# EAGLE design SmartMDCPrint (EAGLE 7.4.0)
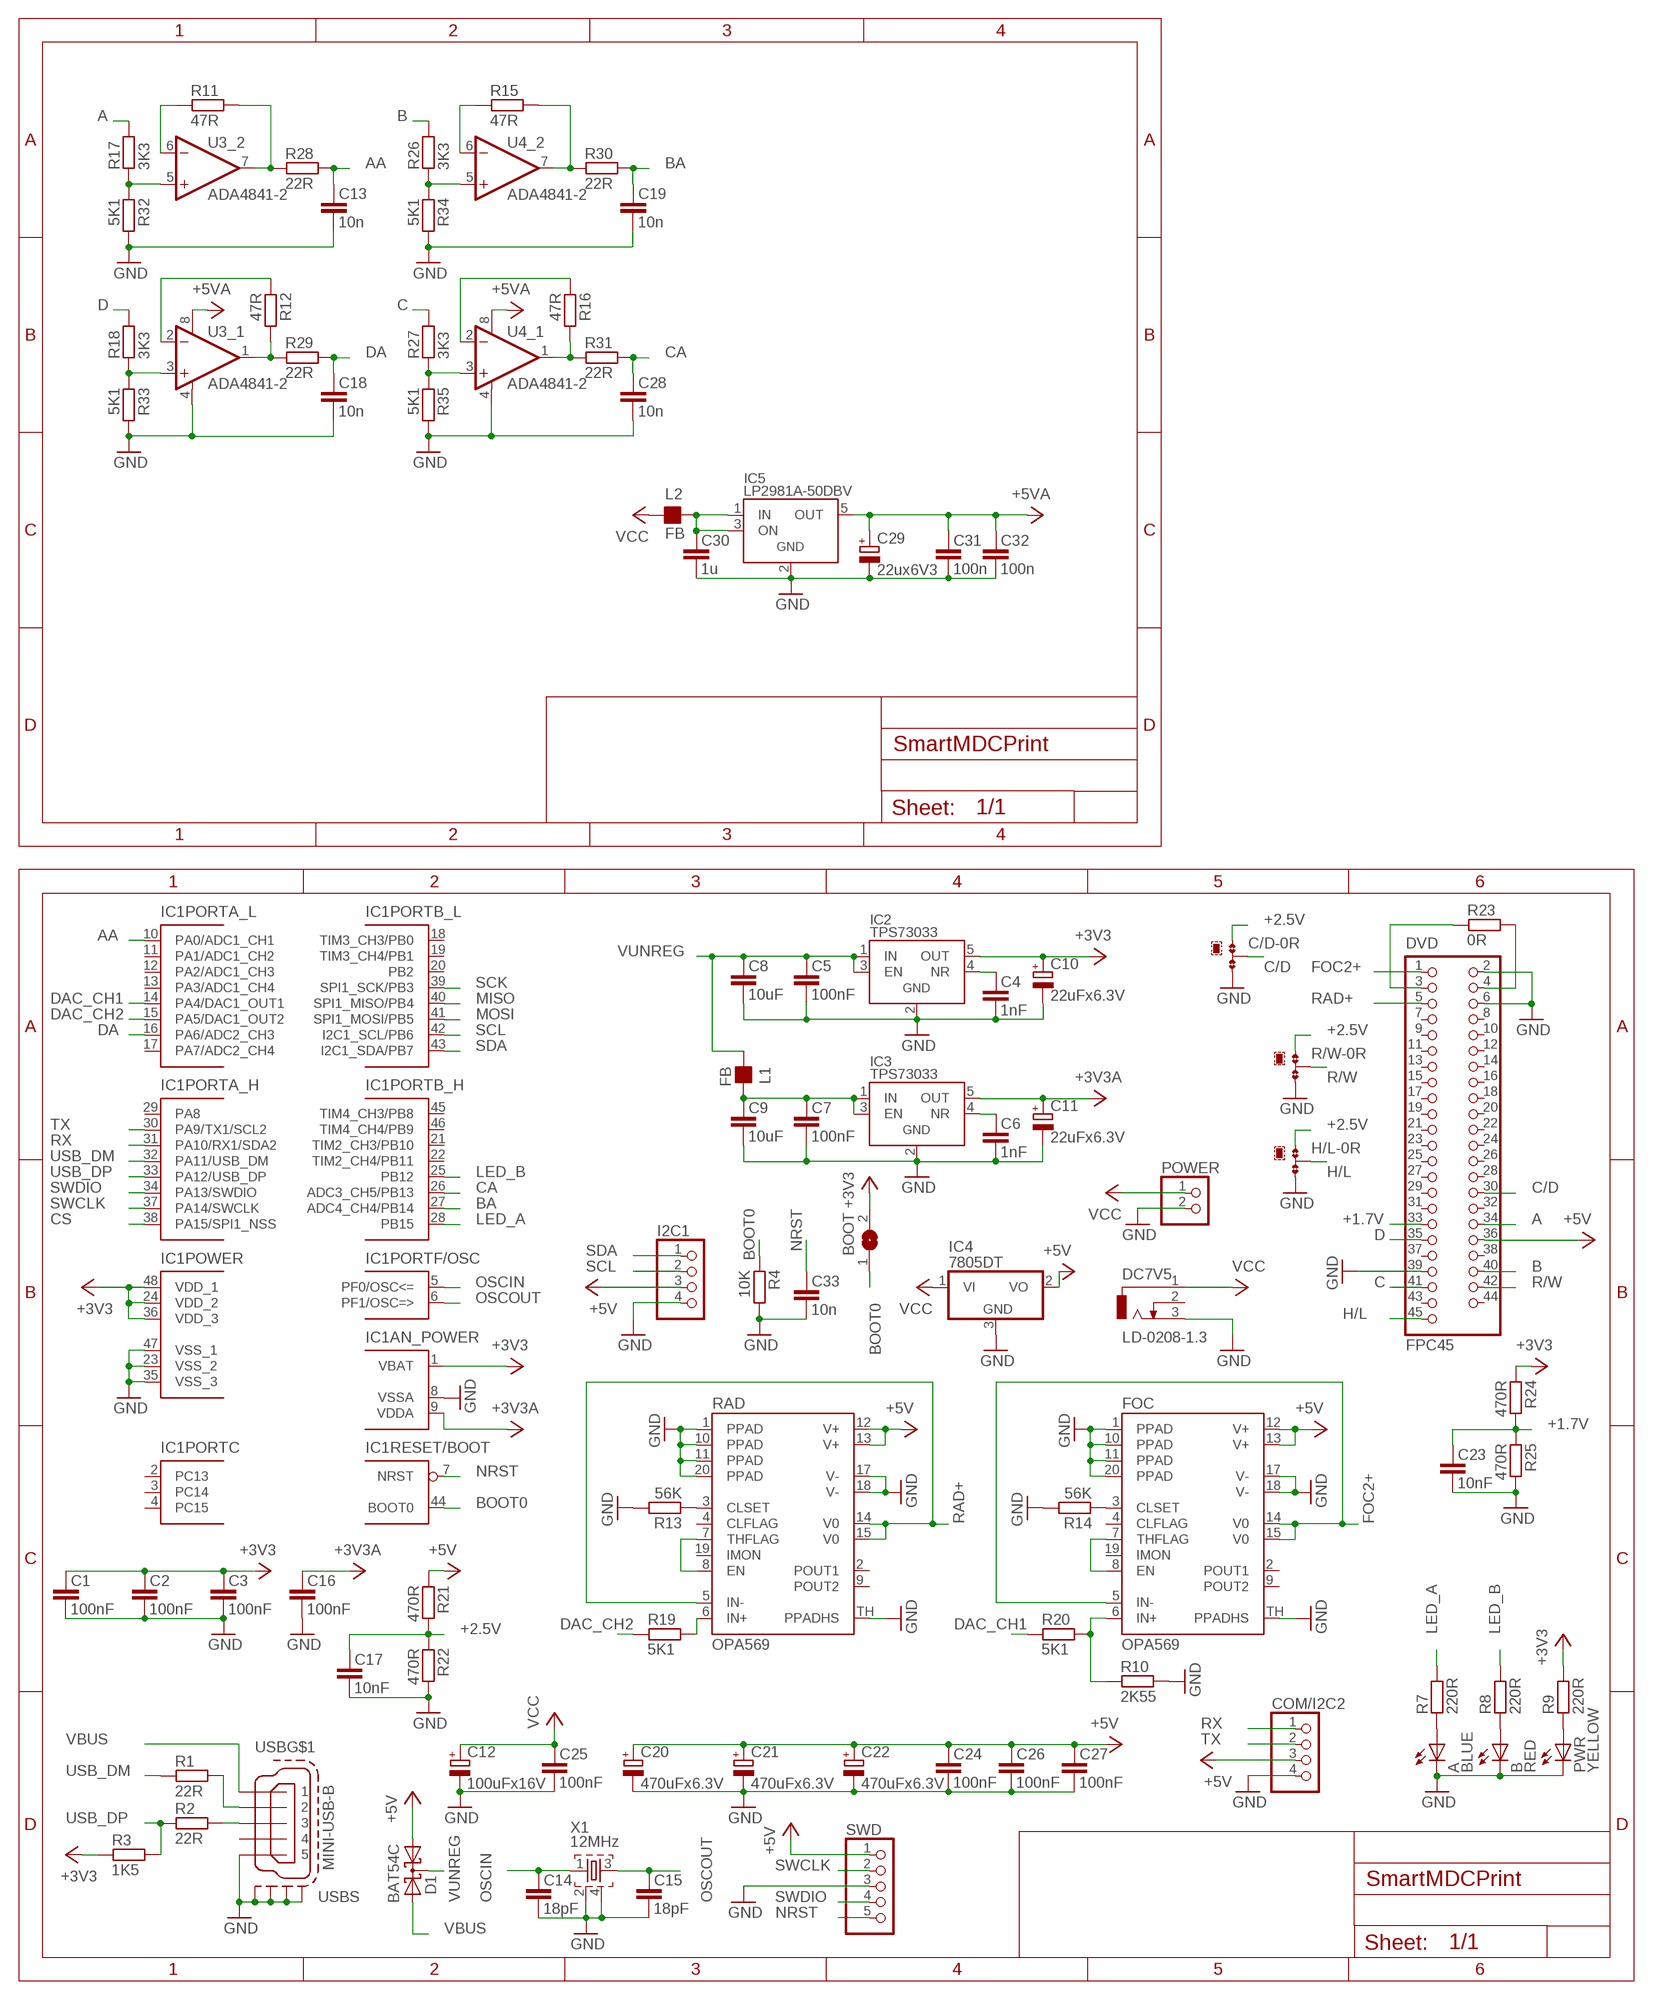
[diagram p0: schematic, sheet 1]

## Parts
A  BLUE  LEDCHIPLED_0805  [CHIPLED_0805]
B  RED  LEDCHIPLED_0805  [CHIPLED_0805]
BOOT  SJ  [SJ]
C1  100nF  C_EU_C0603G  [C0603G]
C2  100nF  C_EU_C0603G  [C0603G]
C3  100nF  C_EU_C0603G  [C0603G]
C4  1nF  C_EU_C0603G  [C0603G]
C5  100nF  C_EU_C0603G  [C0603G]
C6  1nF  C_EU_C0603G  [C0603G]
C7  100nF  C_EU_C0603G  [C0603G]
C8  10uF  C_EU_C0805  [C0805]
C9  10uF  C_EU_C0805  [C0805]
C10  22uFx6.3V  CPOL-EUSMCA  [SMC_A]
C11  22uFx6.3V  CPOL-EUSMCA  [SMC_A]
C12  100uFx16V  CPOL-EUE2.5-7  [E2,5-7]
C13  10n  C_EU_C0603G  [C0603G]
C14  18pF  C_EU_C0603G  [C0603G]
C15  18pF  C_EU_C0603G  [C0603G]
C16  100nF  C_EU_C0603G  [C0603G]
C17  10nF  C_EU_C0603G  [C0603G]
C18  10n  C_EU_C0603G  [C0603G]
C19  10n  C_EU_C0603G  [C0603G]
C20  470uFx6.3V  CPOL-EUSMCD  [SMC_D]
C21  470uFx6.3V  CPOL-EUSMCD  [SMC_D]
C22  470uFx6.3V  CPOL-EUSMCD  [SMC_D]
C23  10nF  C_EU_C0603G  [C0603G]
C24  100nF  C_EU_C0603G  [C0603G]
C25  100nF  C_EU_C0603G  [C0603G]
C26  100nF  C_EU_C0603G  [C0603G]
C27  100nF  C_EU_C0603G  [C0603G]
C28  10n  C_EU_C0603G  [C0603G]
C29  22ux6V3  CPOL-EUSMCA  [SMC_A]
C30  1u  C_EU_C0603G  [C0603G]
C31  100n  C_EU_C0603G  [C0603G]
C32  100n  C_EU_C0603G  [C0603G]
C33  10n  C_EU_C0603G  [C0603G]
C/D  0R-JUMPA  [A0R-JMP]
COM/I2C2  PINHD-1X4  [1X04]
D1  BAT54C  [SOT23]
DC7V5  LD-0208-1.3  [LD-0208]
DVD  FPC45  CON-FPC45  [FPC45]
FOC  OPA569  [SO-20]
H/L  0R-JUMPA  [A0R-JMP]
I2C1  PINHD-1X4  [1X04]
IC1  STM32F303CCT6  STM32F303CXT6  [LQFP48]
IC2  TPS73033  TPS769XX  [SOT23-5]
IC3  TPS73033  TPS769XX  [SOT23-5]
IC4  7805DT  [TO252]
IC5  LP2981A-50DBV  [SOT23-5]
L1  FB  FB_0603  [L0603]
L2  FB  FB_0603  [L0603]
POWER  PINHD-1X2  [1X02]
PWR  YELLOW  LEDCHIPLED_0805  [CHIPLED_0805]
R1  22R  R_EU_R0603  [R0603]
R2  22R  R_EU_R0603  [R0603]
R3  1K5  R_EU_R0603  [R0603]
R4  10K  R_EU_R0603G  [R0603G]
R7  220R  R_EU_R0603  [R0603]
R8  220R  R_EU_R0603  [R0603]
R9  220R  R_EU_R0603  [R0603]
R10  2K55  R_EU_R0603G  [R0603G]
R11  47R  R_EU_R0603  [R0603]
R12  47R  R_EU_R0603  [R0603]
R13  56K  R_EU_R0603G  [R0603G]
R14  56K  R_EU_R0603G  [R0603G]
R15  47R  R_EU_R0603  [R0603]
R16  47R  R_EU_R0603  [R0603]
R17  3K3  R_EU_R0603  [R0603]
R18  3K3  R_EU_R0603  [R0603]
R19  5K1  R_EU_R0603  [R0603]
R20  5K1  R_EU_R0603  [R0603]
R21  470R  R_EU_R0603  [R0603]
R22  470R  R_EU_R0603G  [R0603G]
R23  0R  R_EU_R0603  [R0603]
R24  470R  R_EU_R0603  [R0603]
R25  470R  R_EU_R0603G  [R0603G]
R26  3K3  R_EU_R0603  [R0603]
R27  3K3  R_EU_R0603  [R0603]
R28  22R  R_EU_R0603  [R0603]
R29  22R  R_EU_R0603  [R0603]
R30  22R  R_EU_R0603  [R0603]
R31  22R  R_EU_R0603  [R0603]
R32  5K1  R_EU_R0603G  [R0603G]
R33  5K1  R_EU_R0603G  [R0603G]
R34  5K1  R_EU_R0603G  [R0603G]
R35  5K1  R_EU_R0603G  [R0603G]
R/W  0R-JUMPA  [A0R-JMP]
RAD  OPA569  [SO-20]
SWD  PINHD-1X5  [1X05]
U3  ADA4841-2  [SOIC-8]
U4  ADA4841-2  [SOIC-8]
USB  MINI-USB-B  MINI-USB-SCHIELD-32005-201  [32005-201]
X1  12MHz  ABMM2  [ABMM2]

## Nets
+1.7V: C23.1 DVD.33 R24.2 R25.1
+2.5V: C17.1 C/D.1 H/L.1 R21.2 R22.1 R/W.1
+3V3: BOOT.2 C1.1 C2.1 C3.1 C10.+ IC1.1(AN_POWER:VBAT) IC1.24(POWER:VDD_2) IC1.36(POWER:VDD_3) IC1.48(POWER:VDD_1) IC2.5(OUT) R3.1 R9.2 R24.1
+3V3A: C11.+ C16.1 IC1.9(AN_POWER:VDDA) IC3.5(OUT)
+5V: C20.+ C21.+ C22.+ C24.1 C26.1 C27.1 COM/I2C2.3 D1.1(A1) DVD.36 FOC.12(V+) FOC.13(V+) I2C1.3 IC4.2(VO) R21.1 RAD.12(V+) RAD.13(V+) SWD.1
+5VA: C29.+ C31.1 C32.1 IC5.5(OUT) U3.8(_1:V+) U4.8(_1:V+)
A: DVD.34 R17.2
AA: C13.1 IC1.10(PORTA_L:PA0/ADC1_CH1) R28.2
B: DVD.40 R26.2
BA: C19.1 IC1.27(PORTB_H:ADC4_CH4/PB14) R30.2
BOOT0: BOOT.1 IC1.44(RESET/BOOT:BOOT0) R4.1
C: DVD.41 R27.2
C/D: C/D.2 DVD.30
CA: C28.1 IC1.26(PORTB_H:ADC3_CH5/PB13) R31.2
CS: IC1.38(PORTA_H:PA15/SPI1_NSS)
D: DVD.35 R18.2
DA: C18.1 IC1.16(PORTA_L:PA6/ADC2_CH3) R29.2
DAC_CH1: IC1.14(PORTA_L:PA4/DAC1_OUT1) R20.1
DAC_CH2: IC1.15(PORTA_L:PA5/DAC1_OUT2) R19.1
FOC2+: DVD.1 FOC.5(IN-) FOC.14(V0) FOC.15(V0)
GND: A.C B.C C1.2 C2.2 C3.2 C4.2 C5.2 C6.2 C7.2 C8.2 C9.2 C10.- C11.- C12.- C13.2 C14.2 C15.2 C16.2 C17.2 C18.2 C19.2 C20.- C21.- C22.- C23.2 C24.2 C25.2 C26.2 C27.2 C28.2 C29.- C30.2 C31.2 C32.2 C33.2 C/D.3 COM/I2C2.4 DC7V5.3 DVD.2 DVD.6 DVD.39 FOC.1(PPAD) FOC.10(PPAD) FOC.11(PPAD) FOC.17(V-) FOC.18(V-) FOC.20(PPAD) FOC.TH(PPADHS) H/L.3 I2C1.4 IC1.8(AN_POWER:VSSA) IC1.23(POWER:VSS_2) IC1.35(POWER:VSS_3) IC1.47(POWER:VSS_1) IC2.2(GND) IC3.2(GND) IC4.3(GND) IC5.2(GND) POWER.2 PWR.C R4.2 R10.2 R13.2 R14.2 R22.2 R25.2 R32.2 R33.2 R34.2 R35.2 R/W.3 RAD.1(PPAD) RAD.10(PPAD) RAD.11(PPAD) RAD.17(V-) RAD.18(V-) RAD.20(PPAD) RAD.TH(PPADHS) SWD.3 U3.4(_1:V-) U4.4(_1:V-) USB.5 USB.M1(S:S1) USB.M2(S:S2) USB.M3(S:S3) USB.M4(S:S4) X1.2 X1.4
H/L: DVD.45 H/L.2
LED_A: IC1.28(PORTB_H:PB15) R7.2
LED_B: IC1.25(PORTB_H:PB12) R8.2
MISO: IC1.40(PORTB_L:SPI1_MISO/PB4)
MOSI: IC1.41(PORTB_L:SPI1_MOSI/PB5)
N$1: C7.1 C9.1 IC3.1(IN) IC3.3(EN) L1.2
N$2: R1.2 USB.2
N$3: R2.2 USB.3
N$4: R11.2 R28.1 U3.7(_2:OUT)
N$5: A.A R7.1
N$6: B.A R8.1
N$7: C4.1 IC2.4(NR)
N$8: C6.1 IC3.4(NR)
N$9: PWR.A R9.1
N$10: R12.2 R29.1 U3.1(_1:OUT)
N$11: R13.1 RAD.3(CLSET)
N$12: R19.2 RAD.6(IN+)
N$13: FOC.6(IN+) R10.1 R20.2
N$14: R15.2 R30.1 U4.7(_2:OUT)
N$15: DVD.3 R23.1
N$16: R16.2 R31.1 U4.1(_1:OUT)
N$17: FOC.7(THFLAG) FOC.8(EN)
N$18: FOC.3(CLSET) R14.1
N$19: R11.1 U3.6(_2:-IN)
N$20: R15.1 U4.6(_2:-IN)
N$21: R16.1 U4.2(_1:-IN)
N$22: R12.1 U3.2(_1:-IN)
N$23: R17.1 R32.1 U3.5(_2:+IN)
N$24: DVD.4 R23.2
N$25: R18.1 R33.1 U3.3(_1:+IN)
N$26: R26.1 R34.1 U4.5(_2:+IN)
N$27: R27.1 R35.1 U4.3(_1:+IN)
N$28: C30.1 IC5.1(IN) IC5.3(ON) L2.2
N$29: RAD.7(THFLAG) RAD.8(EN)
NRST: C33.1 IC1.7(RESET/BOOT:NRST) SWD.5
OSCIN: C14.1 IC1.5(PORTF/OSC:PF0/OSC<=) X1.1
OSCOUT: C15.1 IC1.6(PORTF/OSC:PF1/OSC=>) X1.3
R/W: DVD.42 R/W.2
RAD+: DVD.5 RAD.5(IN-) RAD.14(V0) RAD.15(V0)
RX: COM/I2C2.1 IC1.31(PORTA_H:PA10/RX1/SDA2)
SCK: IC1.39(PORTB_L:SPI1_SCK/PB3)
SCL: I2C1.2 IC1.42(PORTB_L:I2C1_SCL/PB6)
SDA: I2C1.1 IC1.43(PORTB_L:I2C1_SDA/PB7)
SWCLK: IC1.37(PORTA_H:PA14/SWCLK) SWD.2
SWDIO: IC1.34(PORTA_H:PA13/SWDIO) SWD.4
TX: COM/I2C2.2 IC1.30(PORTA_H:PA9/TX1/SCL2)
USB_DM: IC1.32(PORTA_H:PA11/USB_DM) R1.1
USB_DP: IC1.33(PORTA_H:PA12/USB_DP) R2.1 R3.2
VBUS: D1.2(A2) USB.1
VCC: C12.+ C25.1 DC7V5.1 IC4.1(VI) L2.1 POWER.1
VUNREG: C5.1 C8.1 D1.3(CC) IC2.1(IN) IC2.3(EN) L1.1
Unconnected: DC7V5.2 DVD.7 DVD.8 DVD.9 DVD.10 DVD.11 DVD.12 DVD.13 DVD.14 DVD.15 DVD.16 DVD.17 DVD.18 DVD.19 DVD.20 DVD.21 DVD.22 DVD.23 DVD.24 DVD.25 DVD.26 DVD.27 DVD.28 DVD.29 DVD.31 DVD.32 DVD.37 DVD.38 DVD.43 DVD.44 FOC.2(POUT1) FOC.4(CLFLAG) FOC.9(POUT2) FOC.19(IMON) IC1.2(PORTC:PC13) IC1.3(PORTC:PC14) IC1.4(PORTC:PC15) IC1.11(PORTA_L:PA1/ADC1_CH2) IC1.12(PORTA_L:PA2/ADC1_CH3) IC1.13(PORTA_L:PA3/ADC1_CH4) IC1.17(PORTA_L:PA7/ADC2_CH4) IC1.18(PORTB_L:TIM3_CH3/PB0) IC1.19(PORTB_L:TIM3_CH4/PB1) IC1.20(PORTB_L:PB2) IC1.21(PORTB_H:TIM2_CH3/PB10) IC1.22(PORTB_H:TIM2_CH4/PB11) IC1.29(PORTA_H:PA8) IC1.45(PORTB_H:TIM4_CH3/PB8) IC1.46(PORTB_H:TIM4_CH4/PB9) RAD.2(POUT1) RAD.4(CLFLAG) RAD.9(POUT2) RAD.19(IMON) USB.4

## Library data of the parts
A B PWR = SmartMDCPrint:LED
BOOT = SmartMDCPrint:SJ: SMD solder JUMPER
C1-C9 C13-C19 C23-C28 C30-C33 = SmartMDCPrint:C_EU_
C10-C12 C20-C22 C29 = SmartMDCPrint:CPOL-EU: POLARIZED CAPACITOR, European symbol
C/D H/L R/W = jump-0r-smd:0R-JUMP: SMD 0R 0805 Jumper
COM/I2C2 I2C1 = SmartMDCPrint:PINHD-1X4: PIN HEADER
D1 = SmartMDCPrint:BAT54C: Schottky Diodes Source: Fairchild .. BAT54.pdf
DC7V5 = SmartMDCPrint:LD-0208: Straight PCB Mount DC Power Socket 1A, 12 V dc, Nickel Plated
DVD = SmartMDCPrint:CON-FPC
FOC RAD = SmartMDCPrint:OPA569: Burr Brown products from Texas Instruments Rail-to-Rail I/O, 2A POWER AMPLIFIER
IC1 = SmartMDCPrint:STM32F303CXT6: ST STM32F101/103 48pin LQFP
IC2 IC3 = SmartMDCPrint:TPS769XX: Texas Instruments LDO Regulator
IC4 = linear:78*: Positive VOLTAGE REGULATOR Source: http://cache.national.com/ds/LM/LM78L05.pdf http://www.fairchildsemi.com/ds/LM/LM7805.pdf
IC5 = SmartMDCPrint:LP2981A: TEXAS INSTRUMENTS 100-mA ULTRA-LOW DROPOUT REGULATOR WITH SHUTDOWN
L1 L2 = SmartMDCPrint:FB_: FERRITE BEAD
POWER = SmartMDCPrint:PINHD-1X2: PIN HEADER
R1-R4 R7-R35 = SmartMDCPrint:R_EU_
SWD = SmartMDCPrint:PINHD-1X5: PIN HEADER
U3 U4 = SmartMDCPrint:ADA4841
USB = SmartMDCPrint:MINI-USB-SCHIELD-: MINI USB-B Conector Source: www.cypressindustries.com; OC_FARNELL: unknown; OC_NEWARK: unknown
X1 = SmartMDCPrint:ABM

## Board
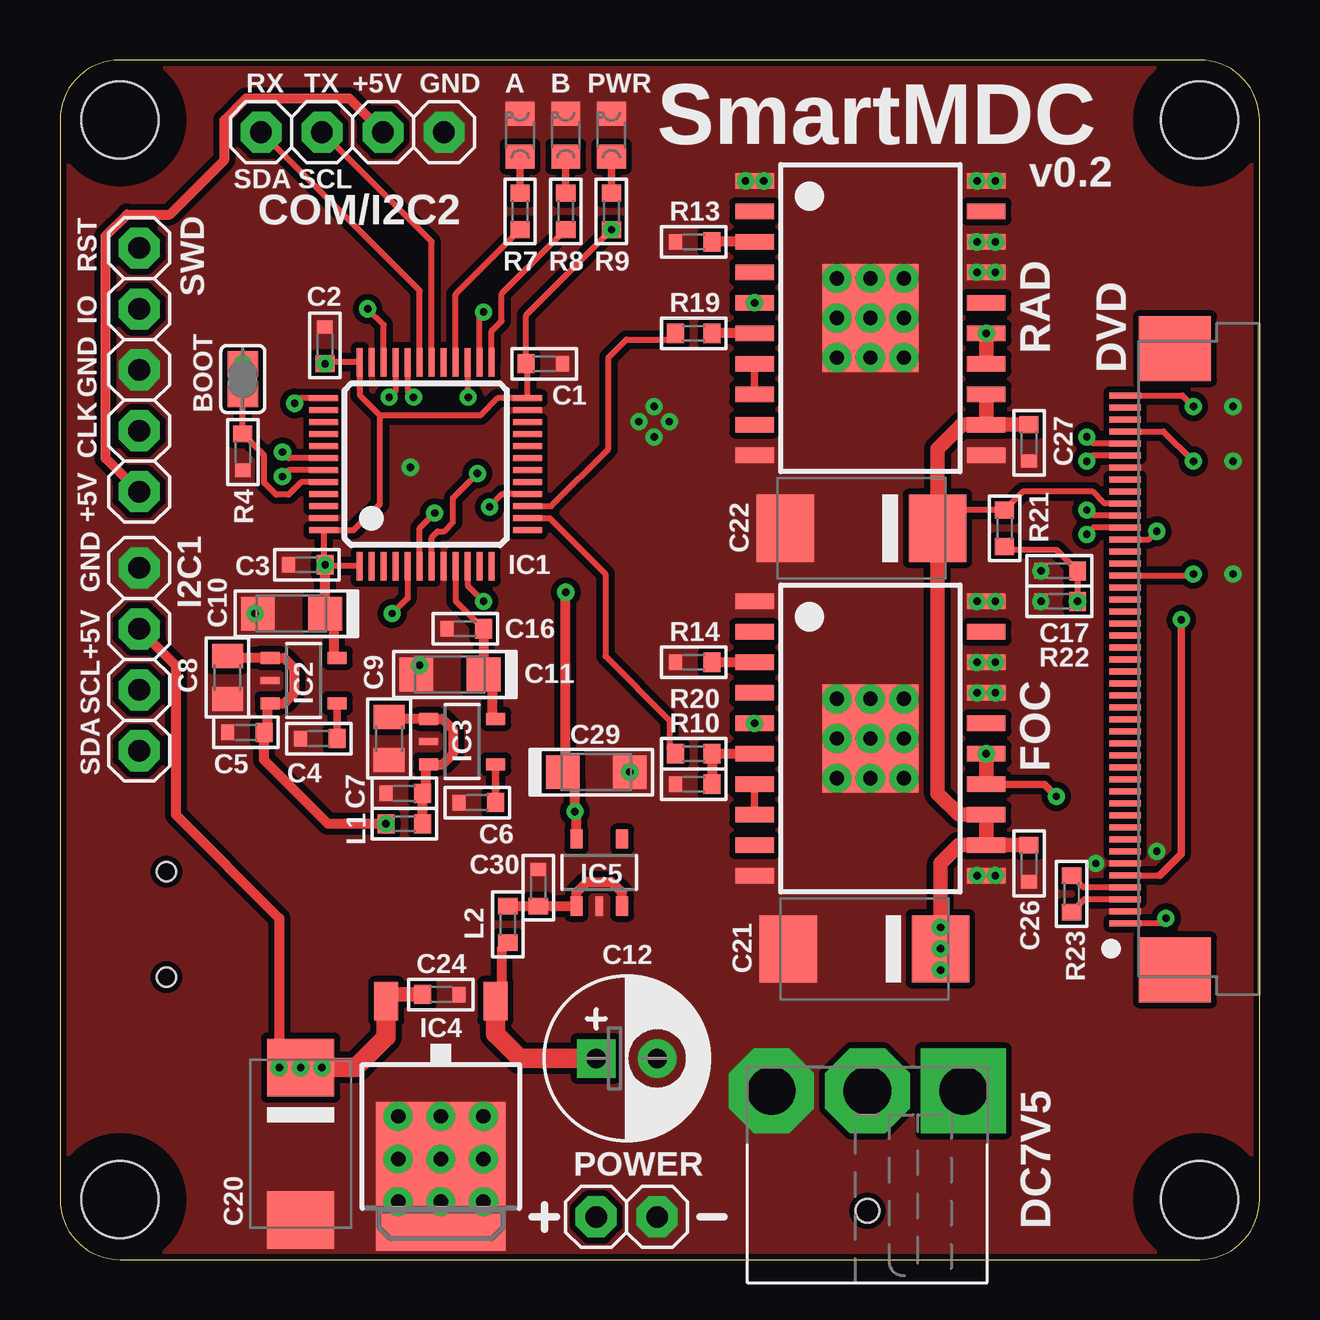
[diagram p1: board, top side]
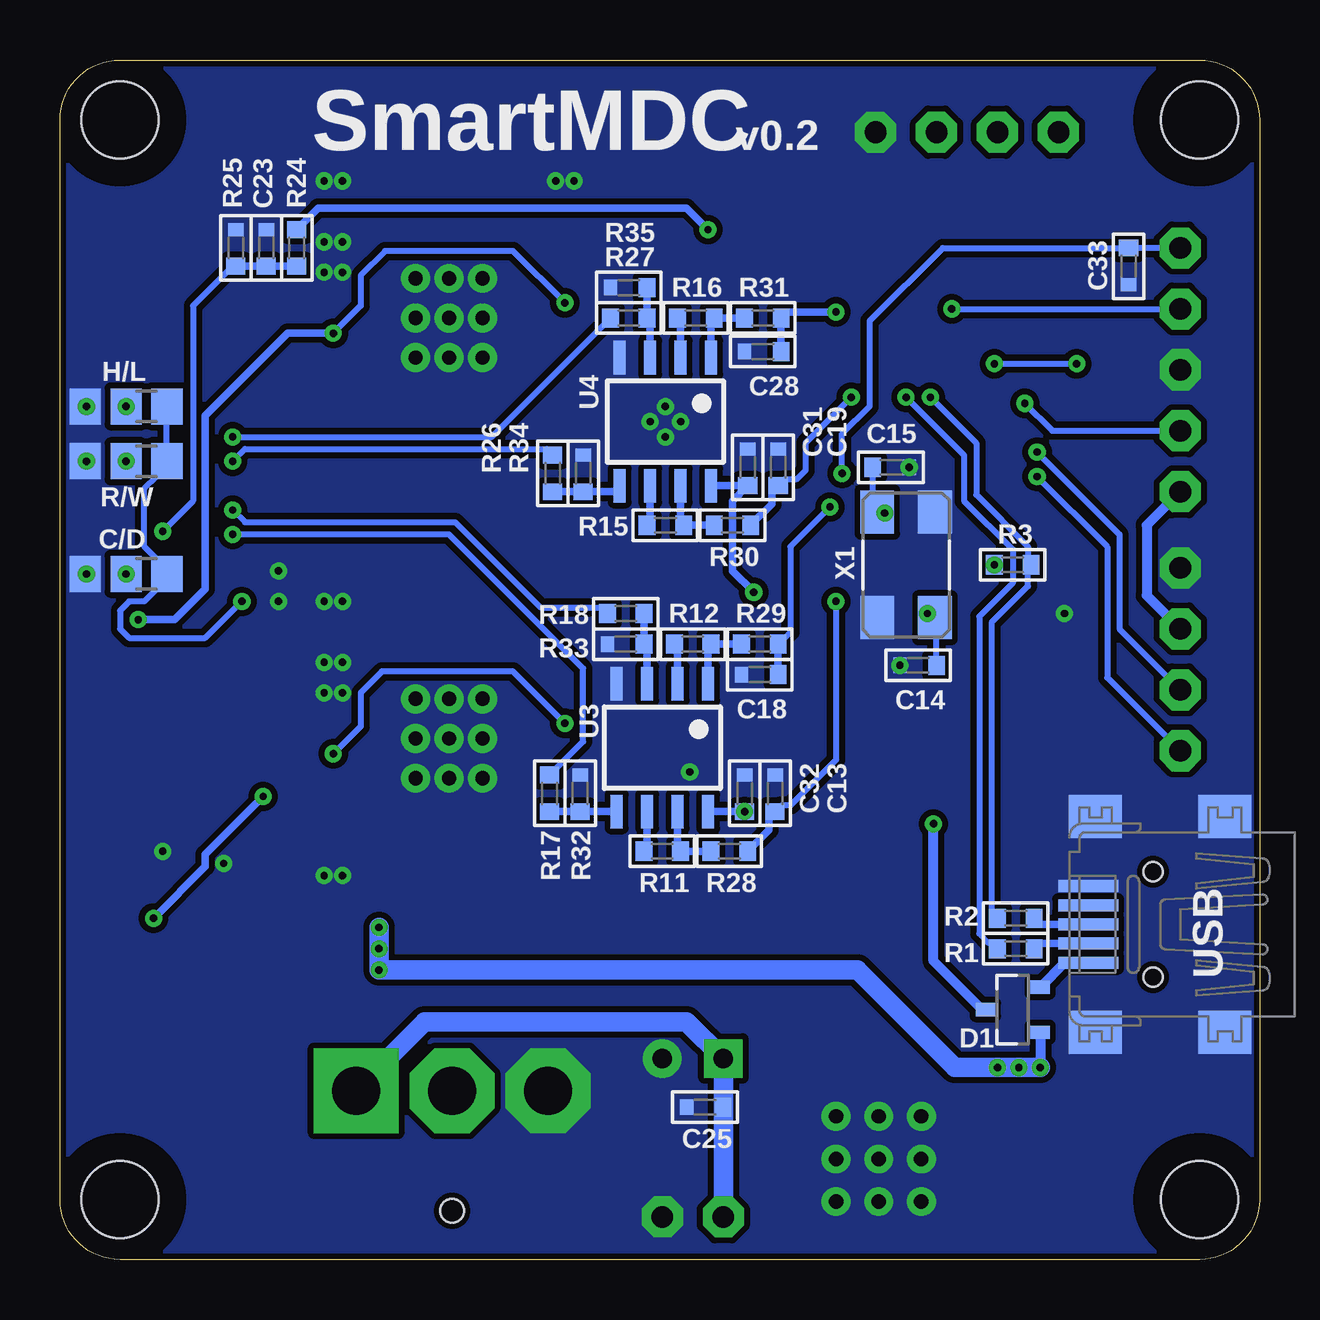
[diagram p2: board, bottom side, seen from below]

Size 50 x 50 mm. Coordinates in mm from the lower left corner, seen from the top.
Outline: 2.5,0 47.5,0 arc90 50,2.5 50,47.5 arc90 47.5,50 2.5,50 arc90 0,47.5 0,2.5 arc90 2.5,0
Copper layers (1*16): Top 0.035mm / dielectric 1.5mm / Bottom 0.035mm
Design rules "default *": minimum track width 8mil, minimum drill 12mil, track to track 8mil, track to pad 8mil, pad to pad 8mil, via to via 8mil, smd to smd 0mil, copper to edge 10mil, drill to drill 8mil, minimum pad ring 10mil, minimum via ring 8mil, stop-mask expansion 4mil, vias tented up to drill 16mil, thermal gap 10mil
Holes 3.2 mm at 2.5,2.5 2.5,47.5 47.5,47.5 47.5,2.5
tRestrict: area 0,45 to 5,50; area 45,45 to 50,50; area 45,0 to 50,5; area 0,0 to 5,5
bRestrict: area 0,45 to 5,50; area 45,45 to 50,50; area 45,0 to 50,5; area 0,0 to 5,5

### Footprints (pad centres in the part's own frame; a part is rotated, then mirrored left to right if it is on the bottom)
CHIPLED_0805 = smd 1.2 x 1: A 0,-0.889; C 0,0.889
SJ = smd 1.067 x 1.27: 1 -0.635,0; 2 0.635,0
C0603G = smd 0.7 x 0.8: 1 -0.762,0 | smd 0.548 x 0.648: 2 0.762,0
C0805 = smd 1 x 1.3: 1 -0.889,0; 2 0.889,0
SMC_A = smd 1.4 x 1.4: + -1.4,0; - 1.4,0
E2,5-7 = drill 0.813 pad 1.6 square: + -1.27,0 | drill 0.813 pad 1.6: - 1.27,0
SMC_D = smd 2.4 x 2.8: + -3.175,0; - 3.175,0
A0R-JMP = smd 1.5 x 1.3: 1 0,1.7; 2 0,0; 3 0,-1.7
1X04 = drill 0.9 octagon: 1 -3.81,0; 2 -1.27,0; 3 1.27,0; 4 3.81,0
SOT23 = smd 0.55 x 0.8: 1 -0.94,-1.143; 2 0.94,-1.143; 3 0,1.143
LD-0208 = drill 2 square: 1 4,5 | drill 2 octagon: 2 0,5; 3 -4,5 | hole 1: 0,0
FPC45 = smd 0.25 x 1.3: 1 -11,3.1; 2 -10.5,3.1; 3 -10,3.1; 4 -9.5,3.1; 5 -9,3.1; 6 -8.5,3.1; 7 -8,3.1; 8 -7.5,3.1; 9 -7,3.1; 10 -6.5,3.1; 11 -6,3.1; 12 -5.5,3.1; 13 -5,3.1; 14 -4.5,3.1; 15 -4,3.1; 16 -3.5,3.1; 17 -3,3.1; 18 -2.5,3.1; 19 -2,3.1; 20 -1.5,3.1; 21 -1,3.1; 22 -0.5,3.1; 23 0,3.1; 24 0.5,3.1; 25 1,3.1; 26 1.5,3.1; 27 2,3.1; 28 2.5,3.1; 29 3,3.1; 30 3.5,3.1; 31 4,3.1; 32 4.5,3.1; 33 5,3.1; 34 5.5,3.1; 35 6,3.1; 36 6.5,3.1; 37 7,3.1; 38 7.5,3.1; 39 8,3.1; 40 8.5,3.1; 41 9,3.1; 42 9.5,3.1; 43 10,3.1; 44 10.5,3.1; 45 11,3.1 | smd 2.7 x 3: S$1 -12.95,1.02; S$2 12.95,1.02
SO-20 = smd 0.65 x 1.6: 1 -5.715,-4.826; 2 -4.445,-4.826; 3 -3.175,-4.826; 4 -1.905,-4.826; 5 -0.635,-4.826; 6 0.635,-4.826; 7 1.905,-4.826; 8 3.175,-4.826; 9 4.445,-4.826; 10 5.715,-4.826; 11 5.715,4.826; 12 4.445,4.826; 13 3.175,4.826; 14 1.905,4.826; 15 0.635,4.826; 16 -0.635,4.826; 17 -1.905,4.826; 18 -3.175,4.826; 19 -4.445,4.826; 20 -5.715,4.826 | smd 4.5 x 4: TH 0,0
LQFP48 = smd 0.25 x 1.2: 1 -2.75,-4.25; 2 -2.25,-4.25; 3 -1.75,-4.25; 4 -1.25,-4.25; 5 -0.75,-4.25; 6 -0.25,-4.25; 7 0.25,-4.25; 8 0.75,-4.25; 9 1.25,-4.25; 10 1.75,-4.25; 11 2.25,-4.25; 12 2.75,-4.25; 25 2.75,4.25; 26 2.25,4.25; 27 1.75,4.25; 28 1.25,4.25; 29 0.75,4.25; 30 0.25,4.25; 31 -0.25,4.25; 32 -0.75,4.25; 33 -1.25,4.25; 34 -1.75,4.25; 35 -2.25,4.25; 36 -2.75,4.25 | smd 1.2 x 0.25: 13 4.25,-2.75; 14 4.25,-2.25; 15 4.25,-1.75; 16 4.25,-1.25; 17 4.25,-0.75; 18 4.25,-0.25; 19 4.25,0.25; 20 4.25,0.75; 21 4.25,1.25; 22 4.25,1.75; 23 4.25,2.25; 24 4.25,2.75; 37 -4.25,2.75; 38 -4.25,2.25; 39 -4.25,1.75; 40 -4.25,1.25; 41 -4.25,0.75; 42 -4.25,0.25; 43 -4.25,-0.25; 44 -4.25,-0.75; 45 -4.25,-1.25; 46 -4.25,-1.75; 47 -4.25,-2.25; 48 -4.25,-2.75
SOT23-5 = smd 0.5 x 0.8: 1 -0.95,-1.397; 3 0.95,-1.397; 4 0.95,1.397; 5 -0.95,1.397 | smd 0.297 x 0.8: 2 0,-1.397
TO252 = smd 1 x 1.6: 1 -2.28,-4.8; 2 2.28,-4.8 | smd 5.4 x 6.2: 3 0,2.5
L0603 = smd 0.7 x 0.8: 1 -0.762,0; 2 0.762,0
1X02 = drill 0.9 octagon: 1 -1.27,0; 2 1.27,0
R0603 = smd 0.7 x 0.8: 1 -0.762,0; 2 0.762,0
R0603G = smd 0.7 x 0.8: 1 -0.762,0 | smd 0.548 x 0.648: 2 0.762,0
1X05 = drill 0.9 octagon: 1 -5.08,0; 2 -2.54,0; 3 0,0; 4 2.54,0; 5 5.08,0
SOIC-8 = smd 0.5 x 1.4: 1 -1.905,-2.667; 2 -0.635,-2.667; 3 0.635,-2.667; 4 1.905,-2.667; 5 1.905,2.667; 6 0.635,2.667; 7 -0.635,2.667; 8 -1.905,2.667
32005-201 = smd 2.5 x 0.5: 1 2.7,1.6; 2 2.7,0.8; 3 2.7,0; 4 2.7,-0.8; 5 2.7,-1.6 | smd 2.2 x 1.8: M1 -3,-4.5; M2 -3,4.5; M3 2.4,4.5; M4 2.4,-4.5 | hole 0.8: 0,2.2; 0,-2.2
ABMM2 = smd 1.8 x 1.4: 1 -2.2,-1.2; 2 2.2,-1.2; 3 2.2,1.2; 4 -2.2,1.2

### Placement (x,y rotation side)
A  19.18,46.86 0 top
B  21.08,46.86 0 top
BOOT  7.62,36.7 90 top
C1  20.19,37.34 0 top
C2  11.05,38.1 90 top
C3  10.29,28.96 180 top
C4  10.79,21.72 180 top
C5  7.75,21.97 180 top
C6  17.4,19.05 180 top
C7  14.35,19.43 180 top
C8  6.99,24.26 270 top
C9  13.72,21.72 270 top
C10  9.65,26.92 180 top
C11  16.26,24.38 180 top
C12  23.62,8.38 0 top
C13  20.19,19.43 90 bottom
C14  14.22,24.77 180 bottom
C15  15.37,33.02 0 bottom
C16  16.89,26.29 180 top
C17  41.66,28.7 180 top
C18  20.83,24.38 180 bottom
C19  20.07,33.02 90 bottom
C20  10.03,4.83 270 top
C21  33.53,12.95 180 top
C22  33.4,30.48 180 top
C23  41.4,42.16 90 bottom
C24  15.88,11.05 0 top
C25  23.11,6.35 180 bottom
C26  40.39,16.51 270 top
C27  40.39,34.04 270 top
C28  20.7,37.85 180 bottom
C29  22.35,20.32 0 top
C30  19.94,15.49 90 top
C31  21.34,33.02 90 bottom
C32  21.46,19.43 90 bottom
C33  5.46,41.4 270 bottom
C/D  47.24,28.57 270 bottom
COM/I2C2  12.19,46.99 0 top
D1  10.29,10.41 90 bottom
DC7V5  33.66,2.03 0 top
DVD  47.5,25.02 90 top
FOC  33.78,21.72 270 top
H/L  47.24,35.56 270 bottom
I2C1  3.3,25.02 90 top
IC1  15.24,33.15 0 top
IC2  10.16,24.13 270 top
IC3  16.76,21.59 270 top
IC4  15.88,5.97 180 top
IC5  22.48,16.13 0 top
L1  14.35,18.16 0 top
L2  18.67,13.97 90 top
POWER  23.62,1.78 0 top
PWR  22.99,46.86 0 top
R1  10.16,12.95 0 bottom
R2  10.16,14.22 0 bottom
R3  10.29,28.96 0 bottom
R4  7.62,33.66 270 top
R7  19.18,43.69 270 top
R8  21.08,43.69 270 top
R9  22.99,43.69 270 top
R10  26.42,19.81 180 top
R11  24.89,17.02 0 bottom
R12  23.62,25.65 0 bottom
R13  26.42,42.42 180 top
R14  26.42,24.89 180 top
R15  24.77,30.61 0 bottom
R16  23.5,39.24 0 bottom
R17  29.59,19.43 90 bottom
R18  26.42,26.92 180 bottom
R19  26.42,38.61 0 top
R20  26.42,21.08 0 top
R21  39.37,30.48 270 top
R22  41.66,27.43 180 top
R23  42.16,15.24 90 top
R24  40.13,42.16 270 bottom
R25  42.67,42.16 90 bottom
R26  29.46,32.77 90 bottom
R27  26.29,39.24 180 bottom
R28  22.1,17.02 0 bottom
R29  20.83,25.65 0 bottom
R30  21.97,30.61 0 bottom
R31  20.7,39.24 0 bottom
R32  28.32,19.43 90 bottom
R33  26.42,25.65 180 bottom
R34  28.19,32.77 90 bottom
R35  26.29,40.51 180 bottom
R/W  47.24,33.27 270 bottom
RAD  33.78,39.24 270 top
SWD  3.3,37.08 90 top
U3  24.89,21.34 180 bottom
U4  24.77,34.92 180 bottom
USB  4.45,13.97 180 bottom
X1  14.73,28.96 90 bottom

### Tracks (layer width: path | path; a pad name or v marks a point on that pad's centre or on a via)
+1.7V  (via drill 0.3)
  Top 0.254: DVD.33 45.39,30.02 v45.72,30.35
  Bottom 0.254: R25.1 42.8,41.4 44.45,39.75 44.45,31.62 v45.72,30.35
  Bottom 0.305: R24.2 C23.1 R25.1
+2.5V  (via drill 0.3)
  Top 0.254: R22.1 C17.1 41.53,29.59 39.5,29.59 R21.2
  Bottom 0.254: H/L.1 R/W.1 45.97,32.84 45.97,32.64 46.48,32.13 46.48,29.72 45.54,28.78 C/D.1 45.54,28.37 46.48,27.43 47.12,27.43 47.5,27.05 47.5,26.29 47.12,25.91 43.94,25.91 R22.1
  other vias: 42.42,27.43
+3V3  (via drill 0.3)
  Top 0.254: C2.1 11.11,37.4 IC1.36 12.49,36.02 13.34,35.18 | IC1.1 11.11,28.9 C3.1 10.99,29.02 IC1.48 12.24,30.4 13.34,31.5 13.34,35.18 | 13.34,35.18 17.53,35.18 18.24,35.9 IC1.24 19.49,37.28 C1.1 19.43,39.37 R9.2
  Top 0.406: IC2.5 11.56,25.15 11.43,25.27 11.43,26.55 C10.+ C3.1
  Bottom 0.254: C2.1 BOOT.2
  Bottom 0.305: R9.2 23.88,43.81 39.24,43.81 R24.1
  other vias: 11.05,28.96 22.99,42.93 11.05,37.34 7.62,37.34
+3V3A
  Top 0.254: IC1.9 16.49,27.45 C16.1
  Top 0.406: IC3.5 18.03,22.67 18.03,24.01 C11.+ C16.1
+5V  (via drill 0.3)
  Top 0.254: C22.+ 36.58,30.1 37.21,29.46 | 36.7,31.75 36.58,31.62 | 36.58,31.24 R21.1 40.13,32 43.05,32 43.54,31.52 DVD.36
  Top 0.406: I2C1.3 4.83,24.77 4.83,18.54 9.14,14.22 v9.14,8 | COM/I2C2.3 12.06,48.39 7.75,48.39 6.86,47.5 6.86,45.85 4.57,43.56 2.79,43.56 1.91,42.67 1.91,33.4 SWD.1
  Top 0.61: FOC.12 FOC.13 37.47,18.54 36.58,19.43 C22.+ 36.58,31.24 36.58,31.62 36.58,33.78 37.59,34.8 RAD.12 | C21.+ 36.7,16.51 37.47,17.27 FOC.12 | FOC.12 C26.1 | RAD.12 RAD.13 | RAD.12 C27.1 | 13.62,10.79 IC4.2 13.88,11.05 C24.1
  Top 0.813: C20.+ 12.32,8 13.59,9.27 IC4.2
  Bottom 0.406: SWD.1 4.7,30.61 4.7,27.69 I2C1.3 | D1.1 v9.14,8
  Bottom 0.813: v9.14,8 C20.+ v10.92,8 12.7,8 16.76,12.06 v36.7,12.06 C21.+ v36.7,13.84
  other vias: 10.03,8 36.7,12.95
+5VA  (via drill 0.3)
  Top 0.406: IC5.5 21.53,18.6 C32.1 21.46,19.81 C29.+ 21.08,20.45 v21.08,27.81
  Bottom 0.305: U3.8 C32.1 | U4.8 C31.1 21.97,31.62 21.97,28.7 v21.08,27.81
  other vias: 21.46,18.67
A  (via drill 0.3)
  Top 0.254: DVD.34 43.09,30.52 v42.8,30.23
  Bottom 0.254: v42.8,30.23 33.78,30.23 28.19,24.64 28.19,21.59 R17.2
AA  (via drill 0.3)
  Top 0.254: IC1.10 16.99,28.09 v17.65,27.43
  Bottom 0.254: v17.65,27.43 17.65,20.83 19.56,18.92 19.94,18.92 C13.1
  Bottom 0.305: R28.2 20.45,17.91 20.45,18.41 C13.1
B  (via drill 0.3)
  Top 0.254: DVD.40 43.04,33.52 v42.8,33.27
  Bottom 0.254: v42.8,33.27 42.29,33.78 29.72,33.78 R26.2
BA  (via drill 0.3)
  Top 0.254: IC1.27 16.99,35.97 v17.02,35.94
  Bottom 0.254: v17.02,35.94 18.92,34.04 18.92,32.89 19.3,32.51 19.81,32.51 C19.1
  Bottom 0.305: C19.1 20.32,32 20.32,31.5 R30.2
BOOT0
  Top 0.254: IC1.44 10.04,32.4 9.53,31.88 9.02,31.88 8.51,32.38 8.51,33.53 R4.1 BOOT.1
C  (via drill 0.3)
  Top 0.254: DVD.41 43.07,34.02 v42.8,34.29
  Bottom 0.254: R27.2 32,34.29 v42.8,34.29
C/D  (via drill 0.3)
  Top 0.254: DVD.30 47.19,28.52 C/D.2
  other vias: 47.24,28.57
CA  (via drill 0.3)
  Top 0.254: IC1.26 17.49,39.33 v17.65,39.5
  Bottom 0.305: v17.65,39.5 19.68,39.5 R31.2 C28.1
D  (via drill 0.3)
  Top 0.254: DVD.35 43.02,31.02 v42.8,31.24
  Bottom 0.254: R18.2 27.43,27.18 29.97,27.18 33.53,30.73 42.29,30.73 v42.8,31.24
DA  (via drill 0.3)
  Top 0.254: IC1.16 18.43,31.9 v17.91,31.37
  Bottom 0.254: v17.91,31.37 19.56,29.72 19.56,26.16 R29.2
  Bottom 0.305: C18.1 R29.2
DAC_CH1
  Top 0.254: IC1.14 20.41,30.9 22.73,28.57 22.73,25.15 25.4,22.48 25.4,21.34 R20.1
DAC_CH2
  Top 0.254: IC1.15 20.48,31.4 22.86,33.78 22.86,37.59 23.62,38.35 25.4,38.35 R19.1
FOC2+  (via drill 0.3)
  Top 0.254: v46.1,14.22 45.9,14.02 DVD.1
  Top 0.305: FOC.14 41.02,19.81 v41.53,19.3
  Top 0.61: FOC.15 FOC.14
  Bottom 0.254: FOC.5 31.11,24.51 36.58,24.51 37.47,23.62 37.47,22.23 FOC.15
  Bottom 0.305: v46.1,14.22 43.94,16.38 43.94,16.89 v41.53,19.3
  other vias: 28.96,22.35 38.61,21.08
GND  (via drill 0.3, 0.6)
  other vias: 32.38,40.89 33.78,40.89 35.18,40.89 32.38,39.24 32.38,37.59 33.78,39.24 35.18,39.24 33.78,37.59 35.18,37.59 32.38,23.37 32.38,21.72 32.38,20.07 33.78,23.37 35.18,23.37 35.18,21.72 35.18,20.07 33.78,20.07 33.78,21.72 15.88,5.97 14.1,5.97 17.65,5.97 14.1,4.19 14.1,2.41 15.88,4.19 17.65,4.19 15.88,2.41 17.65,2.41 23.75,20.32 14.61,33.02 14.99,24.77 48.9,35.56 48.9,33.27 48.9,28.57 40.89,28.7 40.89,27.43 45.72,17.02 43.18,16.51 24.13,34.92 25.4,34.92 38.99,27.43 38.23,27.43 38.99,24.89 38.23,24.89 38.99,23.62 38.23,23.62 38.23,16 38.99,16 38.23,44.96 38.99,44.96 38.23,42.42 38.99,42.42 38.23,41.15 38.99,41.15 28.57,44.96 29.34,44.96 8.13,26.92 24.77,35.56 24.77,34.29
  pour Bottom (isolate 0.254, no thermals): 0,0 0,50 50,50 50,0
  pour Top (isolate 0.254, no thermals): 0,0 0,50 50,50 50,0
H/L  (via drill 0.3)
  Top 0.254: DVD.45 46.78,36.02 H/L.2
  other vias: 47.24,35.56
LED_A
  Top 0.254: IC1.28 16.49,40.24 R7.2
LED_B
  Top 0.254: IC1.25 17.99,38.69 18.41,39.12 18.41,40.26 R8.2
N$1
  Top 0.406: L1.2 C7.1 15.24,19.56 15.24,20.51 IC3.3 15.94,20.64 16.38,21.08 16.38,22.1 15.94,22.54 IC3.1 13.78,22.54 C9.1
N$2
  Bottom 0.305: USB.2 9.18,13.17 R1.2
N$3
  Bottom 0.305: USB.3 9.14,13.97 R2.2
N$4
  Bottom 0.305: U3.7 24.26,17.14 R11.2 R28.1
N$5
  Top 0.305: R7.1 A.A
N$6
  Top 0.305: R8.1 B.A
N$7
  Top 0.305: IC2.4 C4.1
N$8
  Top 0.305: IC3.4 C6.1
N$9
  Top 0.305: R9.1 PWR.A
N$10
  Bottom 0.305: U3.1 22.99,25.53 R12.2 R29.1
N$11
  Top 0.406: RAD.3 R13.1
N$12
  Top 0.406: RAD.6 R19.2
N$13
  Top 0.406: FOC.6 R20.2 R10.1
N$14
  Bottom 0.305: U4.7 24.13,30.73 R15.2 R30.1
N$15
  Top 0.254: DVD.3 42.7,15.02 R23.1
N$16
  Bottom 0.305: U4.1 22.86,39.12 R16.2 R31.1
N$17
  Top 0.305: FOC.7 FOC.8
N$18
  Top 0.406: FOC.3 R14.1
N$19
  Bottom 0.305: U3.6 25.53,17.14 R11.1
N$20
  Bottom 0.305: U4.6 25.4,30.73 R15.1
N$21
  Bottom 0.305: U4.2 24.13,39.12 R16.1
N$22
  Bottom 0.305: U3.2 24.26,25.53 R12.1
N$23
  Bottom 0.305: U3.5 R32.1 R17.1
N$24
  Top 0.254: DVD.4 42.65,15.52 R23.2
N$25
  Bottom 0.305: U3.3 25.53,25.53 R33.1 R18.1
N$26
  Bottom 0.305: R26.1 R34.1 26.67,32 U4.5
N$27
  Bottom 0.305: U4.3 25.4,39.12 R27.1 R35.1
N$28
  Top 0.406: IC5.3 23.43,15.31 22.99,15.75 21.97,15.75 21.53,15.31 IC5.1 C30.1 L2.2
N$29
  Top 0.305: RAD.7 RAD.8
NRST  (via drill 0.3)
  Top 0.254: IC1.7 15.49,30.09 15.75,30.35 16,30.35 16.38,30.73 16.38,31.75 v17.4,32.77
  Bottom 0.254: v17.4,32.77 17.4,34.42 16.26,35.56 16.26,39.12 13.21,42.16 C33.1 SWD.5
OSCIN  (via drill 0.3)
  Top 0.254: IC1.5 14.49,27.57 v13.84,26.92
  Bottom 0.254: v13.84,26.92 13.68,26.76 X1.1 13.46,26.69 C14.1
OSCOUT  (via drill 0.3)
  Top 0.254: IC1.6 14.99,30.48 v15.62,31.11
  Bottom 0.254: C15.1 16.13,31.35 X1.3 15.66,31.16 v15.62,31.11
R/W  (via drill 0.3)
  Top 0.254: DVD.42 46,34.52 R/W.2
  other vias: 47.24,33.27
RAD+  (via drill 0.3)
  Top 0.254: DVD.5 45.85,16.02
  Top 0.305: v46.74,26.67 46.74,16.91 45.85,16.02
  Top 0.61: RAD.15 RAD.14
  Bottom 0.254: RAD.5 31.11,42.04 36.45,42.04 37.47,41.02 37.47,39.75 RAD.15
  Bottom 0.305: RAD.15 40.51,38.61 43.94,35.18 43.94,27.94 45.21,26.67 v46.74,26.67
  other vias: 28.96,39.88 38.61,38.61
RX
  Top 0.254: IC1.31 14.99,40.38 COM/I2C2.1
SCL  (via drill 0.3)
  Top 0.254: IC1.42 9.53,33.4 v9.27,33.66
  Bottom 0.254: v9.27,33.66 5.84,30.23 5.84,26.29 I2C1.2
SDA  (via drill 0.3)
  Top 0.254: IC1.43 9.53,32.9 v9.27,32.64
  Bottom 0.254: v9.27,32.64 6.35,29.72 6.35,24.26 I2C1.1
SWCLK  (via drill 0.3)
  Top 0.254: IC1.37 9.99,35.9 v9.78,35.69
  Bottom 0.254: v9.78,35.69 8.64,34.54 SWD.2
SWDIO  (via drill 0.3)
  Top 0.254: IC1.34 13.49,38.96 v12.83,39.62
  Bottom 0.254: v12.83,39.62 SWD.4
TX
  Top 0.254: IC1.30 15.49,42.42 COM/I2C2.2
USB_DM  (via drill 0.3)
  Top 0.254: IC1.32 14.49,36.18 v14.73,35.94
  Bottom 0.254: v14.73,35.94 12.32,33.53 12.32,31.62 10.29,29.59 10.29,28.19 11.68,26.8 11.68,13.59 11.3,13.21 11.18,13.21 R1.1
USB_DP  (via drill 0.3)
  Top 0.254: IC1.33 13.99,36.22 v13.72,35.94
  Bottom 0.254: v13.72,35.94 11.81,34.04 11.81,31.88 9.65,29.72 9.65,29.08 R3.2 9.65,28.83 9.65,28.07 11.18,26.54 11.18,14.48 R2.1
VBUS
  Bottom 0.406: USB.1 8.13,12.37 D1.2
VCC
  Top 0.406: L2.1 18.41,12.95 18.41,11.03 IC4.1
  Top 0.813: IC4.1 18.16,9.4 19.18,8.38 C12.+
  Bottom 0.813: POWER.1 C25.1 C12.+ 23.88,9.91 34.8,9.91 37.66,7.05 DC7V5.1
VUNREG  (via drill 0.3)
  Top 0.406: C8.1 7.05,25.08 IC2.1 9.34,25.08 9.78,24.64 9.78,23.62 9.34,23.18 IC2.3 8.7,23.18 8.64,23.11 8.64,22.1 C5.1 8.51,20.83 11.18,18.16 L1.1
  Bottom 0.406: D1.3 11.56,10.41 13.59,12.45 L1.1
  other vias: 13.59,18.16

### Text on the board
bPlace: v0.2 | SmartMDC
tNames: RX | TX | +5V | GND | SmartMDC | SDA | SCL | v0.2 | RST | IO | GND | CLK | +5V | GND | +5V | SCL | SDA